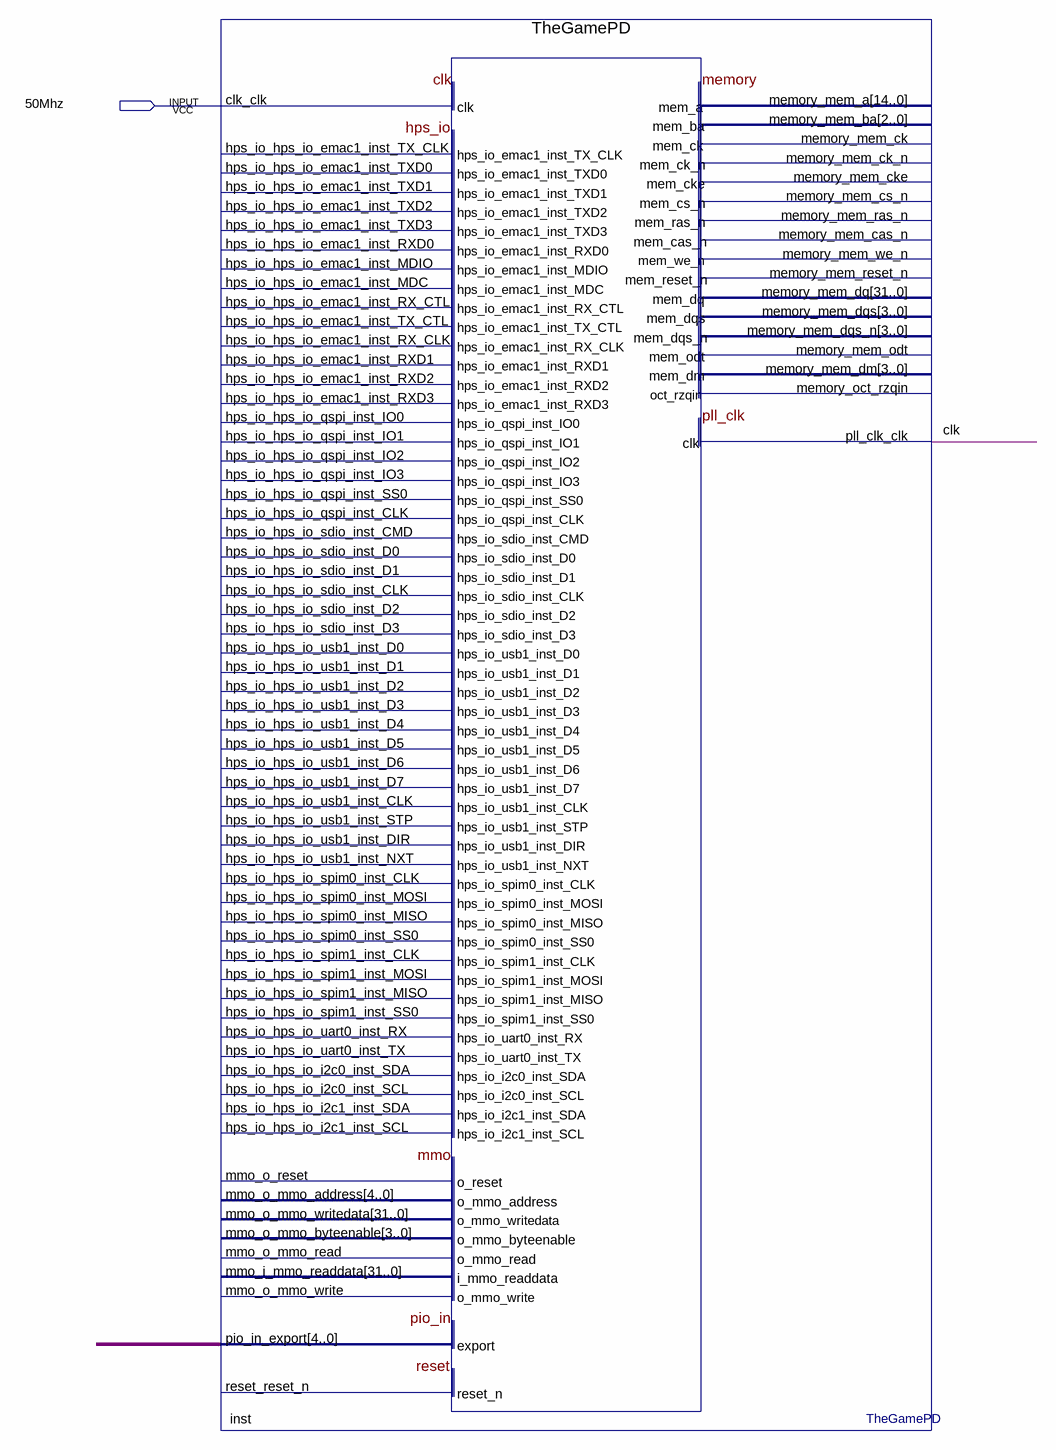
[diagram p0: schematic sheet]
// Quartus schematic main.bdf as structural Verilog: 1 symbols, 1 pins
module main (
  input  \50Mhz 
);

  wire clk;
  wire [4:0] undriven;

  TheGamePD inst (
    .clk_clk(\50Mhz ), .pio_in_export(undriven), .pll_clk_clk(clk));  // open: hps_io_hps_io_emac1_inst_RXD0, hps_io_hps_io_emac1_inst_RX_CTL, hps_io_hps_io_emac1_inst_RX_CLK, hps_io_hps_io_emac1_inst_RXD1, hps_io_hps_io_emac1_inst_RXD2, hps_io_hps_io_emac1_inst_RXD3, hps_io_hps_io_usb1_inst_CLK, hps_io_hps_io_usb1_inst_DIR, hps_io_hps_io_usb1_inst_NXT, hps_io_hps_io_spim0_inst_MISO, hps_io_hps_io_spim1_inst_MISO, hps_io_hps_io_uart0_inst_RX, memory_oct_rzqin, mmo_i_mmo_readdata, reset_reset_n, hps_io_hps_io_emac1_inst_TX_CLK, hps_io_hps_io_emac1_inst_TXD0, hps_io_hps_io_emac1_inst_TXD1, hps_io_hps_io_emac1_inst_TXD2, hps_io_hps_io_emac1_inst_TXD3, hps_io_hps_io_emac1_inst_MDC, hps_io_hps_io_emac1_inst_TX_CTL, hps_io_hps_io_qspi_inst_SS0, hps_io_hps_io_qspi_inst_CLK, hps_io_hps_io_sdio_inst_CLK, hps_io_hps_io_usb1_inst_STP, hps_io_hps_io_spim0_inst_CLK, hps_io_hps_io_spim0_inst_MOSI, hps_io_hps_io_spim0_inst_SS0, hps_io_hps_io_spim1_inst_CLK, hps_io_hps_io_spim1_inst_MOSI, hps_io_hps_io_spim1_inst_SS0, hps_io_hps_io_uart0_inst_TX, memory_mem_a, memory_mem_ba, memory_mem_ck, memory_mem_ck_n, memory_mem_cke, memory_mem_cs_n, memory_mem_ras_n, memory_mem_cas_n, memory_mem_we_n, memory_mem_reset_n, memory_mem_odt, memory_mem_dm, mmo_o_reset, mmo_o_mmo_address, mmo_o_mmo_writedata, mmo_o_mmo_byteenable, mmo_o_mmo_read, mmo_o_mmo_write, hps_io_hps_io_emac1_inst_MDIO, hps_io_hps_io_qspi_inst_IO0, hps_io_hps_io_qspi_inst_IO1, hps_io_hps_io_qspi_inst_IO2, hps_io_hps_io_qspi_inst_IO3, hps_io_hps_io_sdio_inst_CMD, hps_io_hps_io_sdio_inst_D0, hps_io_hps_io_sdio_inst_D1, hps_io_hps_io_sdio_inst_D2, hps_io_hps_io_sdio_inst_D3, hps_io_hps_io_usb1_inst_D0, hps_io_hps_io_usb1_inst_D1, hps_io_hps_io_usb1_inst_D2, hps_io_hps_io_usb1_inst_D3, hps_io_hps_io_usb1_inst_D4, hps_io_hps_io_usb1_inst_D5, hps_io_hps_io_usb1_inst_D6, hps_io_hps_io_usb1_inst_D7, hps_io_hps_io_i2c0_inst_SDA, hps_io_hps_io_i2c0_inst_SCL, hps_io_hps_io_i2c1_inst_SDA, hps_io_hps_io_i2c1_inst_SCL, memory_mem_dq, memory_mem_dqs, memory_mem_dqs_n
endmodule
